# Altium schematic sheet Interrupter.SchDoc: Interrupter
size A4; Author: Teslakom 2014; CompanyName: Omega Verksted; DrawnBy: Øystein Smith; PageSetup: Record=PageOptions|CenterHorizontal=False|CenterVertical=False|PrintScale=0.97|XCorrection=1.00|YCorrection=1.00|PrintKind=1|BorderSize=5000000|LeftOffset=0|BottomOffset=0|Orientation=2|PaperLength=1000|PaperWidth=1000|Scale=100|PaperSource=7|PrintQuality=-4|MediaType=1|DitherType=10|PaperKind=A4|PrintScaleMode=1
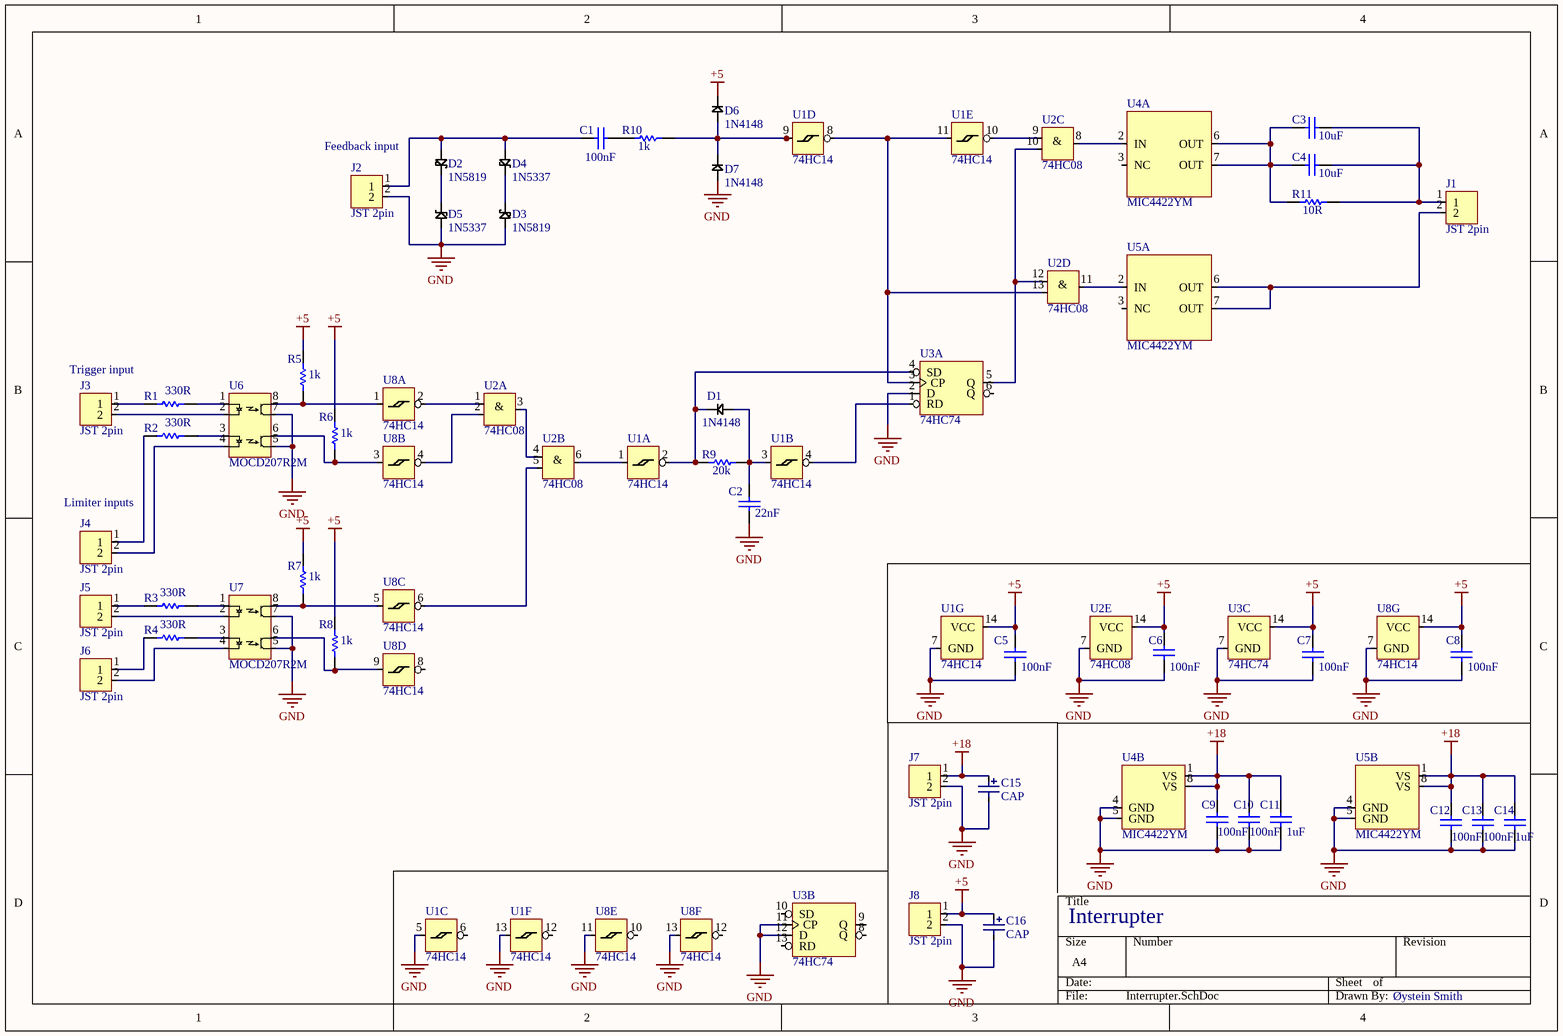
[diagram p0: Interrupter.SchDoc]

## Parts
C1  value 100nF  [CAPC0805(2012)145_L]  (hidden comment: CAP 100nF 25V 0805(2012))
C2  value 22nF  [CAPC0805(2012)145_L]  (hidden comment: CAP 22nF 25V 0805(2012))
C3  value 10uF  [CAPC1206(3216)190_L]  (hidden comment: CAP 10uF 25V 1206(3216))
C4  value 10uF  [CAPC1206(3216)190_L]  (hidden comment: CAP 10uF 25V 1206(3216))
C5  value 100nF  [CAPC0805(2012)145_M]  (hidden comment: CAP 100nF 25V 0805(2012))
C6  value 100nF  [CAPC0805(2012)145_M]  (hidden comment: CAP 100nF 25V 0805(2012))
C7  value 100nF  [CAPC0805(2012)145_M]  (hidden comment: CAP 100nF 25V 0805(2012))
C8  value 100nF  [CAPC0805(2012)145_M]  (hidden comment: CAP 100nF 25V 0805(2012))
C9  value 100nF  [CAPC0805(2012)145_M]  (hidden comment: CAP 100nF 25V 0805(2012))
C10  value 100nF  [CAPC0805(2012)145_M]  (hidden comment: CAP 100nF 25V 0805(2012))
C11  value 1uF  [CAPC0805(2012)145_N]  (hidden comment: CAP 1uF 25V 0805(2012))
C12  value 100nF  [CAPC0805(2012)145_M]  (hidden comment: CAP 100nF 25V 0805(2012))
C13  value 100nF  [CAPC0805(2012)145_M]  (hidden comment: CAP 100nF 25V 0805(2012))
C14  value 1uF  [CAPC0805(2012)145_N]  (hidden comment: CAP 1uF 25V 0805(2012))
C15  CAP  [CAP 2.5mm]
C16  CAP  [CAP 2.5mm]
D1  1N4148  [1N4148]
D2  1N5819  [1N5819]
D3  1N5819  [1N5819]
D4  1N5337  [1N5337]
D5  1N5337  [1N5337]
D6  1N4148  [1N4148]
D7  1N4148  [1N4148]
J1  JST 2pin  [JST 2pin]
J2  JST 2pin  [JST 2pin]
J3  JST 2pin  [JST 2pin]
J4  JST 2pin  [JST 2pin]
J5  JST 2pin  [JST 2pin]
J6  JST 2pin  [JST 2pin]
J7  JST 2pin  [JST 2pin]
J8  JST 2pin  [JST 2pin]
R1  330R  [RESC0805(2012)_L]
R2  value 330R  [RESC0805(2012)_L]  (hidden comment: 330R 5% 0805(2012))
R3  value 330R  [RESC0805(2012)_L]  (hidden comment: 330R 5% 0805(2012))
R4  value 330R  [RESC0805(2012)_L]  (hidden comment: 330R 5% 0805(2012))
R5  value 1k  [RESC0805(2012)_N]  (hidden comment: 1K 5% 0805(2012))
R6  value 1k  [RESC0805(2012)_N]  (hidden comment: 1K 5% 0805(2012))
R7  value 1k  [RESC0805(2012)_N]  (hidden comment: 1K 5% 0805(2012))
R8  value 1k  [RESC0805(2012)_N]  (hidden comment: 1K 5% 0805(2012))
R9  value 20k  [RESC0805(2012)_N]  (hidden comment: 20K 1% 0805(2012))
R10  value 1k  [RESC0805(2012)_M]  (hidden comment: 1K 1% 0805(2012))
R11  value 10R  [RESC0805(2012)_L]  (hidden comment: 10R 5% 0805(2012))
U1  74HC14  [SOP14]  (parts A,B,C,D,E,F,G of 7)
U2  74HC08  [SOP14]  (parts A,B,C,D,E of 5)
U3  74HC74  [SOP14]  (parts A,B,C of 3)
U4  MIC4422YM  [SOP8]  (parts A,B of 2)
U5  MIC4422YM  [SOP8]  (parts A,B of 2)
U6  MOCD207R2M  [SOP8]
U7  MOCD207R2M  [SOP8]
U8  74HC14  [SOP14]  (parts A,B,C,D,E,F,G of 7)

## Nets
+5: C5.2 C6.2 C7.2 C8.2 C16.2 D6.K J8.1 R5.2 R6.2 R7.2 R8.2 U1.14(VCC) U2.14(VCC) U3.14(VCC) U8.14(VCC)
+18: C9.2 C10.2 C11.2 C12.2 C13.2 C14.2 C15.2 J7.1 U4.1(VS) U4.8(VS) U5.1(VS) U5.8(VS)
GND: C2.1 C5.1 C6.1 C7.1 C8.1 C9.1 C10.1 C11.1 C12.1 C13.1 C14.1 C15.1 C16.1 D3.A D5.A D7.A J2.2 J7.2 J8.2 U1.5 U1.7(GND) U1.13 U2.7(GND) U3.2(D) U3.7(GND) U3.11(CP) U3.12(D) U4.4(GND) U4.5(GND) U5.4(GND) U5.5(GND) U6.5 U6.7 U7.5 U7.7 U8.7(GND) U8.11 U8.13
NetC1_1: C1.1 D2.A D4.A J2.1
NetC1_2: C1.2 R10.1
NetC2_2: C2.2 D1.A R9.2 U1.3
NetC3_1: C3.1 C4.1 R11.1 U4.6(OUT) U4.7(OUT)
NetC3_2: C3.2 C4.2 J1.1 R11.2
NetD1_K: D1.K R9.1 U1.2 U3.4(SD)
NetD2_K: D2.K D5.K
NetD3_K: D3.K D4.K
NetD6_A: D6.A D7.K R10.2 U1.9
NetJ1_2: J1.2 U5.6(OUT) U5.7(OUT)
NetJ3_1: J3.1 R1.2
NetJ3_2: J3.2 U6.2
NetJ4_1: J4.1 R2.2
NetJ4_2: J4.2 U6.4
NetJ5_1: J5.1 R3.2
NetJ5_2: J5.2 U7.2
NetJ6_1: J6.1 R4.2
NetJ6_2: J6.2 U7.4
NetR1_1: R1.1 U6.1
NetR2_1: R2.1 U6.3
NetR3_1: R3.1 U7.1
NetR4_1: R4.1 U7.3
NetR5_1: R5.1 U6.8 U8.1
NetR6_1: R6.1 U6.6 U8.3
NetR7_1: R7.1 U7.8 U8.5
NetR8_1: R8.1 U7.6 U8.9
NetU1_1: U1.1 U2.6
NetU1_4: U1.4 U3.1(RD)
NetU1_8: U1.8 U1.11 U2.13 U3.3(CP)
NetU1_10: U1.10 U2.9
NetU2_1: U2.1 U8.2
NetU2_2: U2.2 U8.4
NetU2_3: U2.3 U2.4
NetU2_5: U2.5 U8.6
NetU2_8: U2.8 U4.2(IN)
NetU2_10: U2.10 U2.12 U3.5(Q)
NetU2_11: U2.11 U5.2(IN)

Not connected (* = marked no-connect by the designer): U1 6 12; U3 6(Q) 8(Q) 9(Q) 10(SD) 13(RD); U4 3(NC); U5 3(NC); U8 8 10 12

## Notes on the sheet
- Feedback input
- Trigger input
- (near J4) Limiter inputs
- Interrupter
- Øystein Smith
- (in symbol 74HC08, part A) &
- (in symbol 74HC08, part B) &
- (in symbol 74HC08, part C) &
- (in symbol 74HC08, part D) &

## Library data of the parts
C1 = CMP-1036-04410-1: CAP 100nF 25V ±10% 0805 (2012 Metric) Thickness 1.45mm SMD; Case-Metric: 2012; Case-EIA: 0805; Technology: SMT; Rated Voltage: 25 V; Tolerance: ±10%; Max Thickness: 1.45 mm
C2 = CMP-1036-04050-1: CAP 22nF 25V ±5% 0805 (2012 Metric) Thickness 1.45mm SMD; Case-Metric: 2012; Case-EIA: 0805; Tolerance: ±5%; Technology: SMT; Rated Voltage: 25 V; Max Thickness: 1.45 mm
C3 C4 = CMP-1037-04979-1: CAP 10uF 25V ±10% 1206 (3216 Metric) Thickness 1.9mm SMD; Case-EIA: 1206; Case-Metric: 3216; Rated Voltage: 25 V; Technology: SMT; Tolerance: ±10%; Max Thickness: 1.9 mm
C5-C10 C12 C13 = CMP-1036-04408-1: CAP 100nF 25V ±5% 0805 (2012 Metric) Thickness 1.45mm SMD; Case-Metric: 2012; Case-EIA: 0805; Rated Voltage: 25 V; Max Thickness: 1.45 mm; Technology: SMT; Tolerance: ±5%
C11 C14 = CMP-1036-04752-1: CAP 1uF 25V ±5% 0805 (2012 Metric) Thickness 1.45mm SMD; Case-Metric: 2012; Case-EIA: 0805; Tolerance: ±5%; Technology: SMT; Rated Voltage: 25 V; Max Thickness: 1.45 mm
R1-R4 = CMP-1013-00062-1: 330R 0.125W 5% 0805 (2012 Metric)  SMD; Case-EIA: 0805; Case-Metric: 2012; Tolerance: 5 %; Power: 0.125 W; Technology: SMT
  R1: Value: 330R
R5-R8 = CMP-1013-00074-1: 1K 0.125W 5% 0805 (2012 Metric)  SMD; Case-EIA: 0805; Case-Metric: 2012; Technology: SMT; Power: 0.125 W; Tolerance: 5 %
R9 = CMP-1013-00655-1: 20K 0.125W 1% 0805 (2012 Metric)  SMD; Case-EIA: 0805; Case-Metric: 2012; Power: 0.125 W; Tolerance: 1 %; Technology: SMT
R10 = CMP-1013-00510-1: 1K 0.125W 1% 0805 (2012 Metric)  SMD; Case-Metric: 2012; Case-EIA: 0805; Tolerance: 1 %; Power: 0.125 W; Technology: SMT
R11 = CMP-1013-00026-1: 10R 0.125W 5% 0805 (2012 Metric)  SMD; Case-EIA: 0805; Case-Metric: 2012; Technology: SMT; Power: 0.125 W; Tolerance: 5 %